# Altium schematic sheet SPI_8_bit display.SchDoc
size A4; SheetNumber: 4; SheetTotal: 7
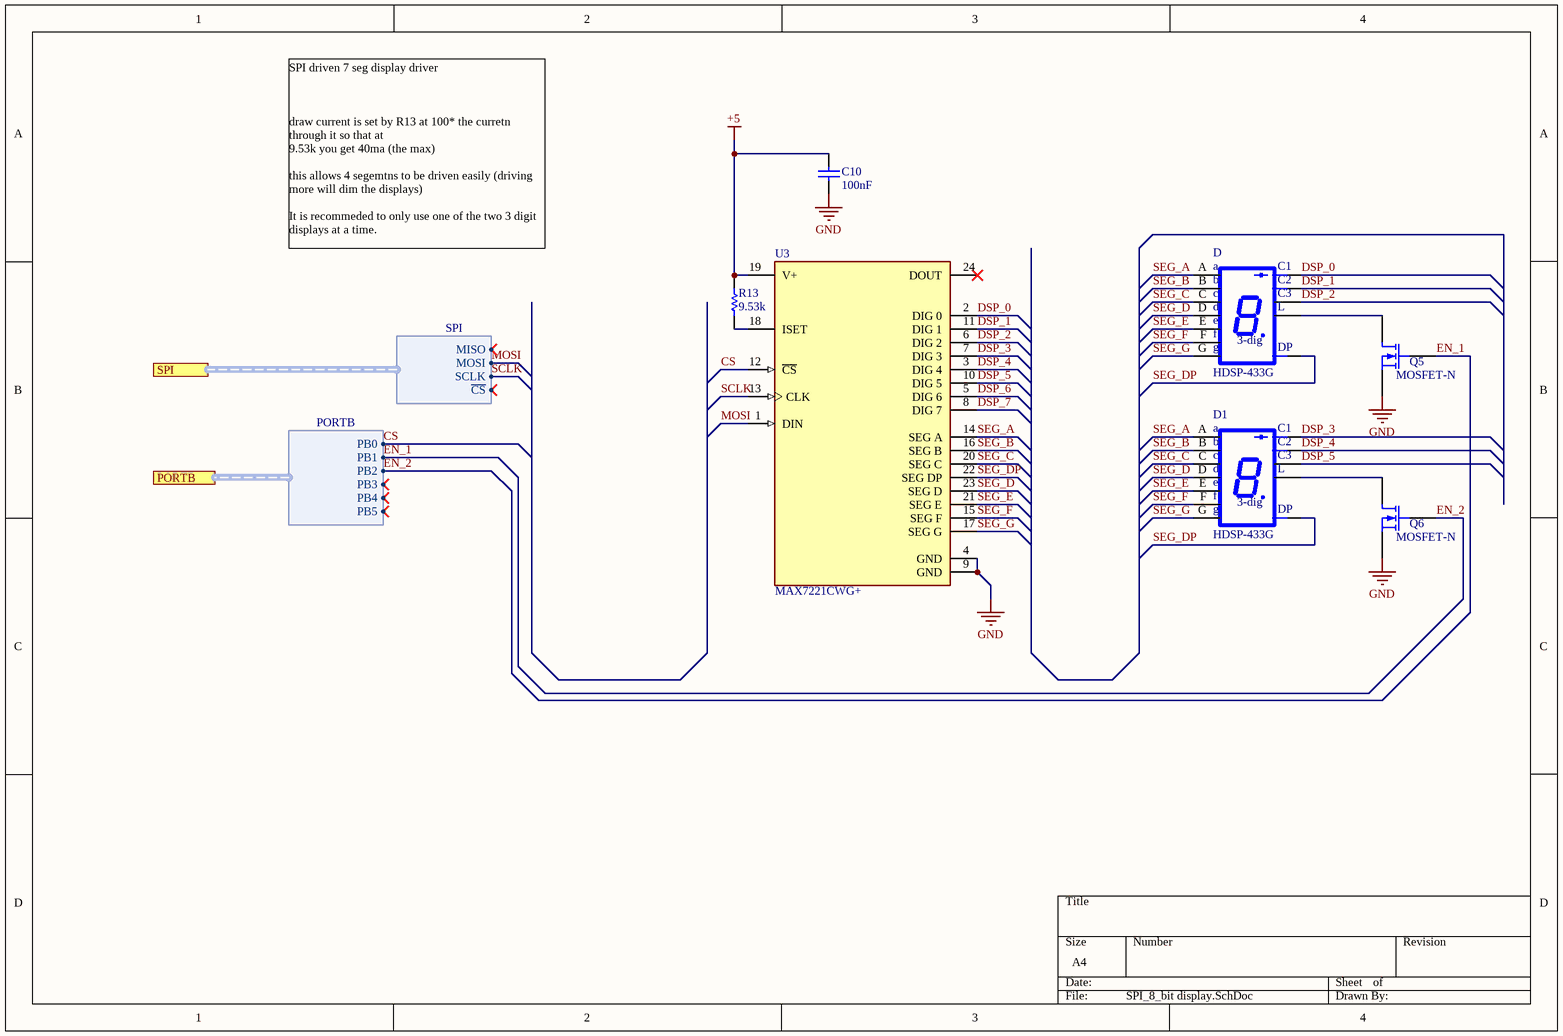
[diagram p0: SPI_8_bit display.SchDoc]

## Parts
C10  100nF
D  HDSP-433G  [HDSP-433G]
D1  HDSP-433G  [HDSP-433G]
Q5  MOSFET-N
Q6  MOSFET-N
R13  9.53k
U3  MAX7221CWG+  [FP-W24-1-MFG]

## Ports
PORTB (harness PORTB), SPI (harness SPI)

## Harnesses
SPI: MISO, MOSI, SCLK, ~{CS}
PORTB: PB0, PB1, PB2, PB3, PB4, PB5

## Nets
+5: C10.2 R13.2 U3.19(V+)
GND: C10.1 Q5.3(S) Q6.3(S) U3.4(GND) U3.9(GND)
CS: U3.12(~{CS}) ; port PORTB.PB0
DSP_0: D.D1(C1) U3.2(DIG_0)
DSP_1: D.D2(C2) U3.11(DIG_1)
DSP_2: D.D3(C3) U3.6(DIG_2)
DSP_3: D1.D1(C1) U3.7(DIG_3)
DSP_4: D1.D2(C2) U3.3(DIG_4)
DSP_5: D1.D3(C3) U3.10(DIG_5)
DSP_6: U3.5(DIG_6)
DSP_7: U3.8(DIG_7)
EN_1: Q5.2(G) Q6.2(G) ; port PORTB.PB1, port PORTB.PB2  [also labelled EN_2]
MOSI: U3.1(DIN) ; port SPI.MOSI
SCLK: U3.13(CLK) ; port SPI.SCLK
SEG_A: D.A D1.A U3.14(SEG_A)
SEG_B: D.B D1.B U3.16(SEG_B)
SEG_C: D.C D1.C U3.20(SEG_C)
SEG_D: D.D D1.D U3.23(SEG_D)
SEG_DP: D.DP D1.DP U3.22(SEG_DP)
SEG_E: D.E D1.E U3.21(SEG_E)
SEG_F: D.F D1.F U3.15(SEG_F)
SEG_G: D.G D1.G U3.17(SEG_G)
NetD1_L: D1.L(P$1) Q6.1(D)
NetD_L: D.L(P$1) Q5.1(D)
NetR13_1: R13.1 U3.18(ISET)

Not connected (* = marked no-connect by the designer): U3 24(DOUT)*

## Notes on the sheet
- SPI driven 7 seg display driver
  draw current is set by R13 at 100* the curretn through it so that at
  9.53k you get 40ma (the max)
  this allows 4 segemtns to be driven easily (driving more will dim the displays)
  It is recommeded to only use one of the two 3 digit displays at a time.
- (in symbol HDSP-433G) a; b; c; d; e; f; 3-dig; g

## Library data of the parts
C10 = 100nF: Capacitor; Published: 8-Jun-2000; LatestRevisionDate: 17-Jul-2002; LatestRevisionNote: Re-released for DXP Platform.; PackageReference: RAD-0.3; Publisher: Altium Limited; PackageDescription: Radial Cap, Thru-Hole; 2 Leads; 0.3 in Pin Spacing
D D1 = HDSP-433G: Display Modules - LED Character and Numeric Green 7-Segment 3 Character Common Cathode 2.25V 20mA 0.504 H x 1.182 W x 0.276 D _12.80mm x 30.02mm x 7.00mm_ 15-DIP _0.400, 10.16mm_, 12 Leads; MF: Broadcom Limited; Package: DIP-15 Broadcom; MP: HDSP-433G; Digi-Key_Purchase_URL: https://www.digikey.com/product-detail/en/broadcom-limited/HDSP-433G/516-3125-ND/2219091?utm_source=snapeda&utm_medium=aggregator&utm_campaign=symbol; Value: *; Digi-Key_Part_Number: 516-3125-ND; SnapEDA_Link: https://www.snapeda.com/parts/HDSP-433G/Broadcom%20Limited/view-part/1760683/?ref=snap
Q5 Q6 = 2N7002: N-Channel MOSFET / 2N7002,215 (SOT23) package; Published: 8-Jun-2000; LatestRevisionDate: 17-Jul-2002; LatestRevisionNote: Re-released for DXP Platform.; PackageVersion: 1995/1996; PackageReference: E3; Publisher: Altium Limited; PackageDescription: TO, Flat Index; 3 In-Line, Axial Leads; Body Dia. 4.6mm; Lead Dia. 0.5 mm (max)
R13 = 9.53k: Resistor; Published: 8-Jun-2000; LatestRevisionDate: 17-Jul-2002; LatestRevisionNote: Re-released for DXP Platform.; PackageReference: AXIAL-0.3; Publisher: Altium Limited; PackageDescription: Axial Device, Thru-Hole; 2 Leads; 0.3 in Pin Spacing
U3 = CMP-05718-000002-1: IC DRVR 7 SEGMNT 8 DIGIT 24SOIC; Manufacturer: Maxim Integrated; Nominal Supply Current: 330mA; Max Power Dissipation: 941mW; Standoff Height: 0.1mm; Min Supply Voltage: 4V; Max Supply Voltage: 5.5V; Max Junction Temp: +150°C; Number Of Outputs: 8; Lead Free: Yes; Device Class L2: Power Management ICs; Height: 2.65mm; Temperature: 0°C to +70°C; Category: IC; Ipc Land Pattern Name: SOIC127P1032X250-24; Temperature Range High: +70°C; Package: W24-1; Manufacturer Part Number: MAX7221CWG+; Device Class L3: LED Drivers; ComponentLink2URL: https://datasheets.maximintegrated.com/en/ds/MAX7219-MAX7221.pdf; Temperature Range Low: 0°C; Device Class L1: Integrated Circuits (ICs); ComponentLink2Description: Datasheet; Digikey Description: IC DRVR 7 SEGMNT 8 DIGIT 24SOIC; Mouser Description: In a Tube of 30, Maxim MAX7221CWG+, LED Driver, 8-Digits 64-Segments, 5 V, 24-Pin SOIC W; RoHS: TRUE; Octopart: https://octopart.com/max7221cwg%2B-maxim+integrated-39581478; Automotive: No; Footprint Url: https://pdfserv.maximintegrated.com/land_patterns/90-0182.PDF